# EAGLE board motor_controller (EAGLE 9.6.2)
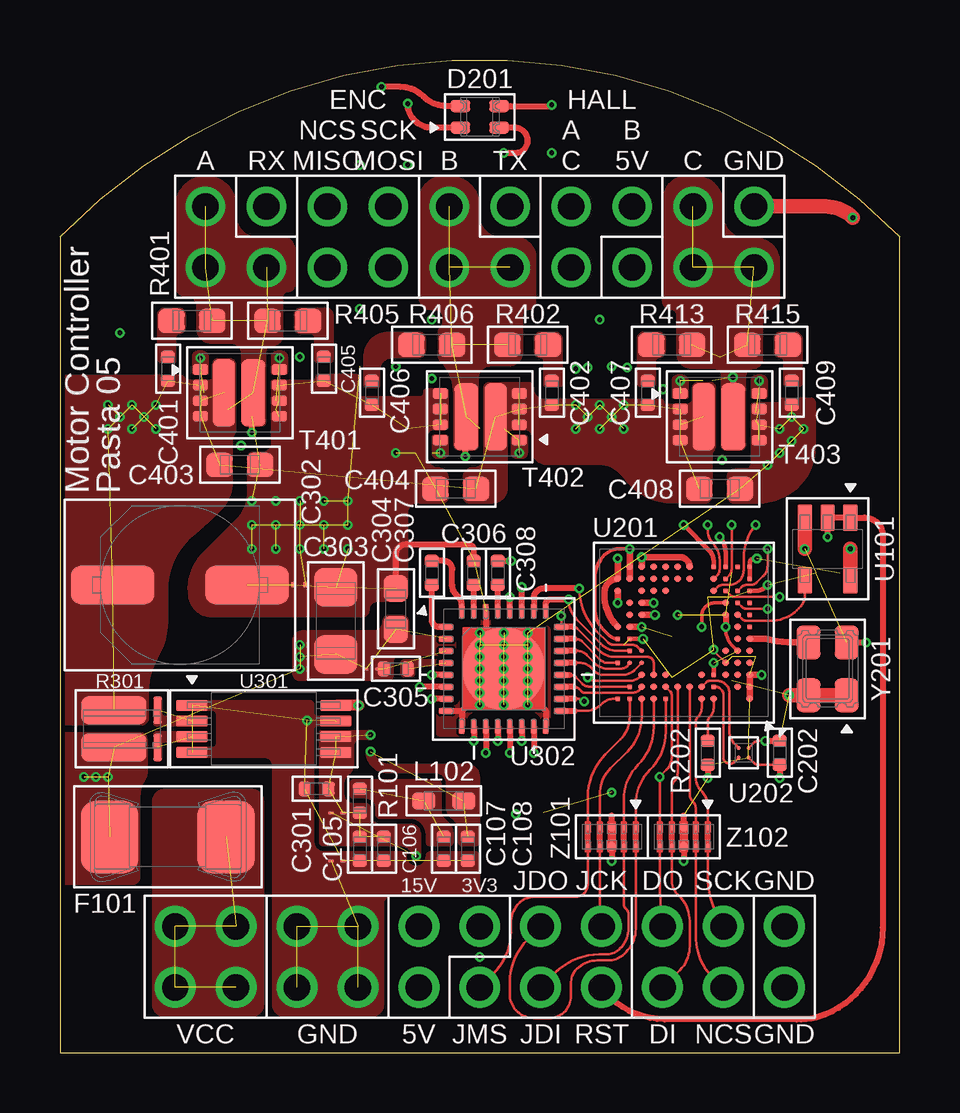
[diagram p4: board, top side]
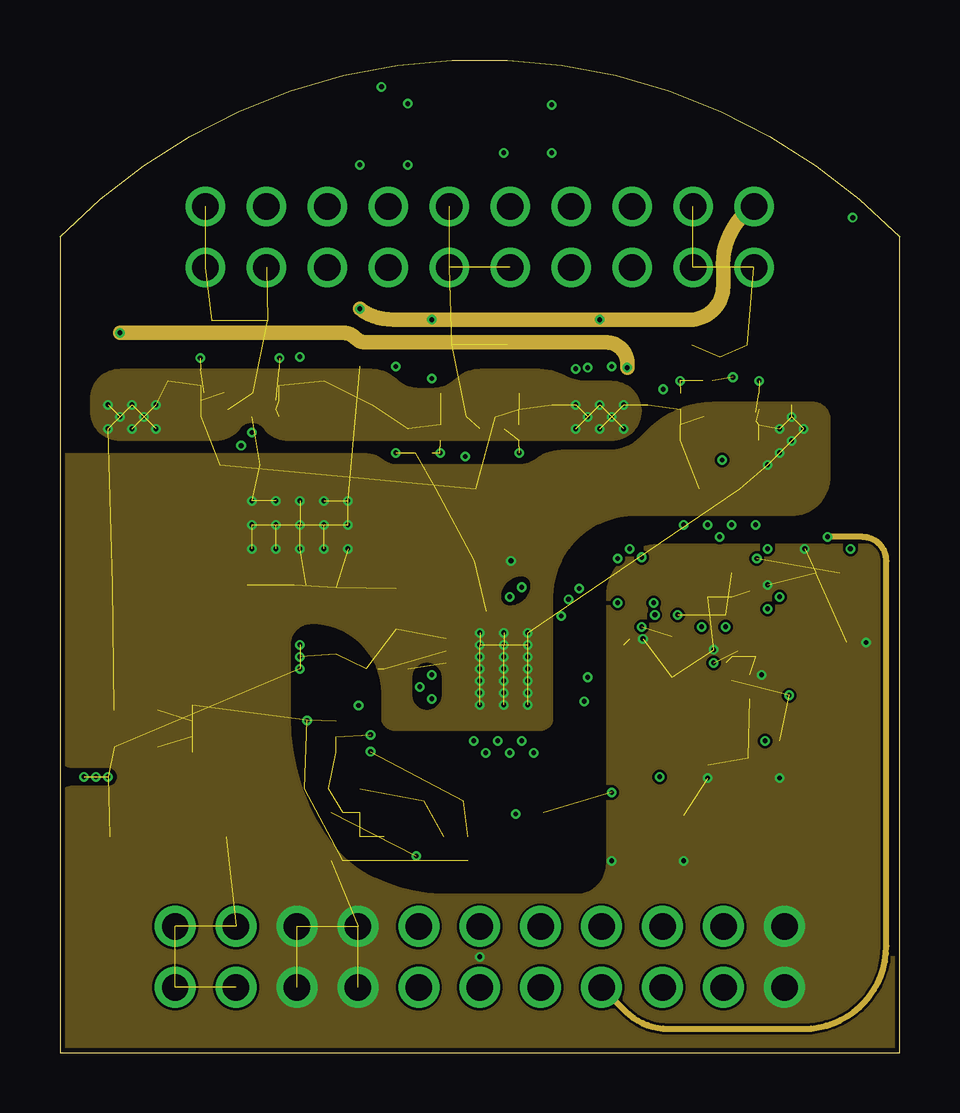
[diagram p5: board, inner layer Route2]
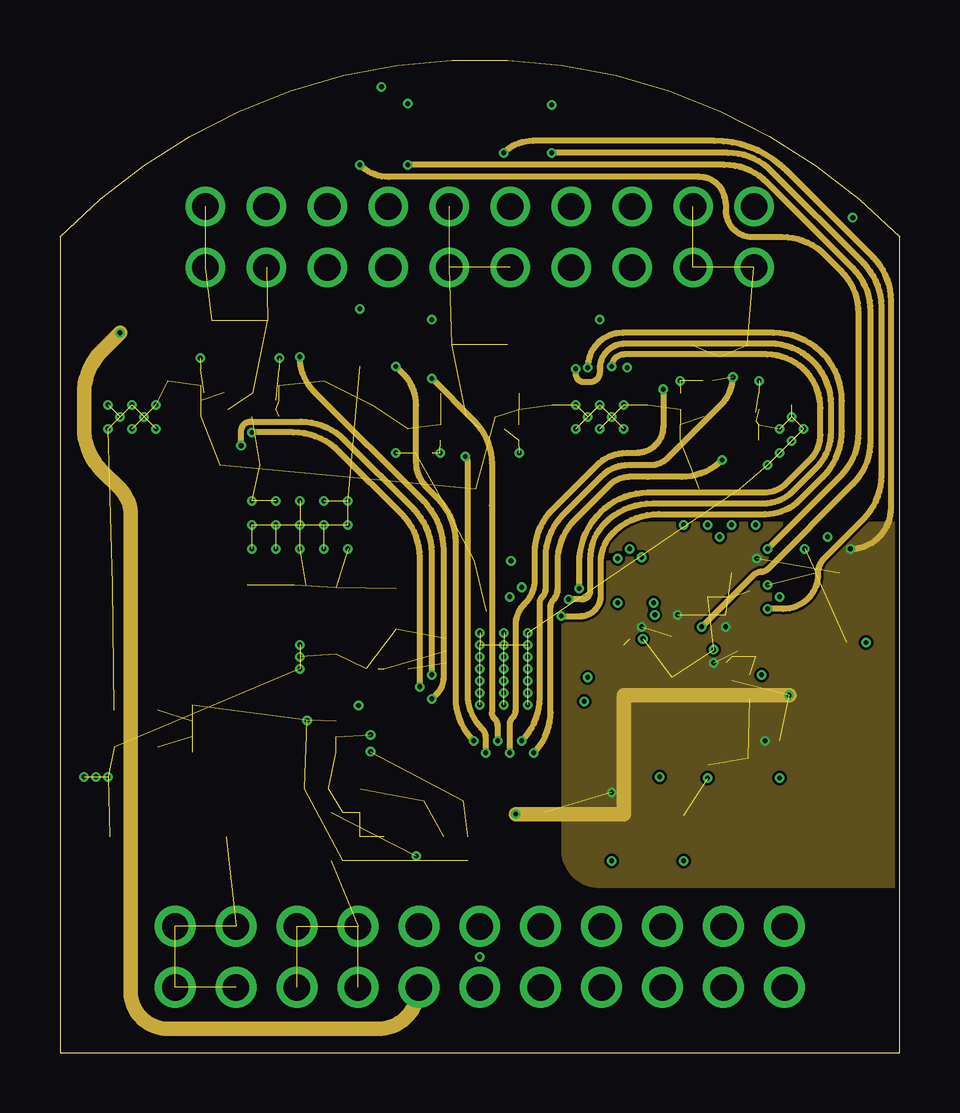
[diagram p6: board, inner layer Route15]
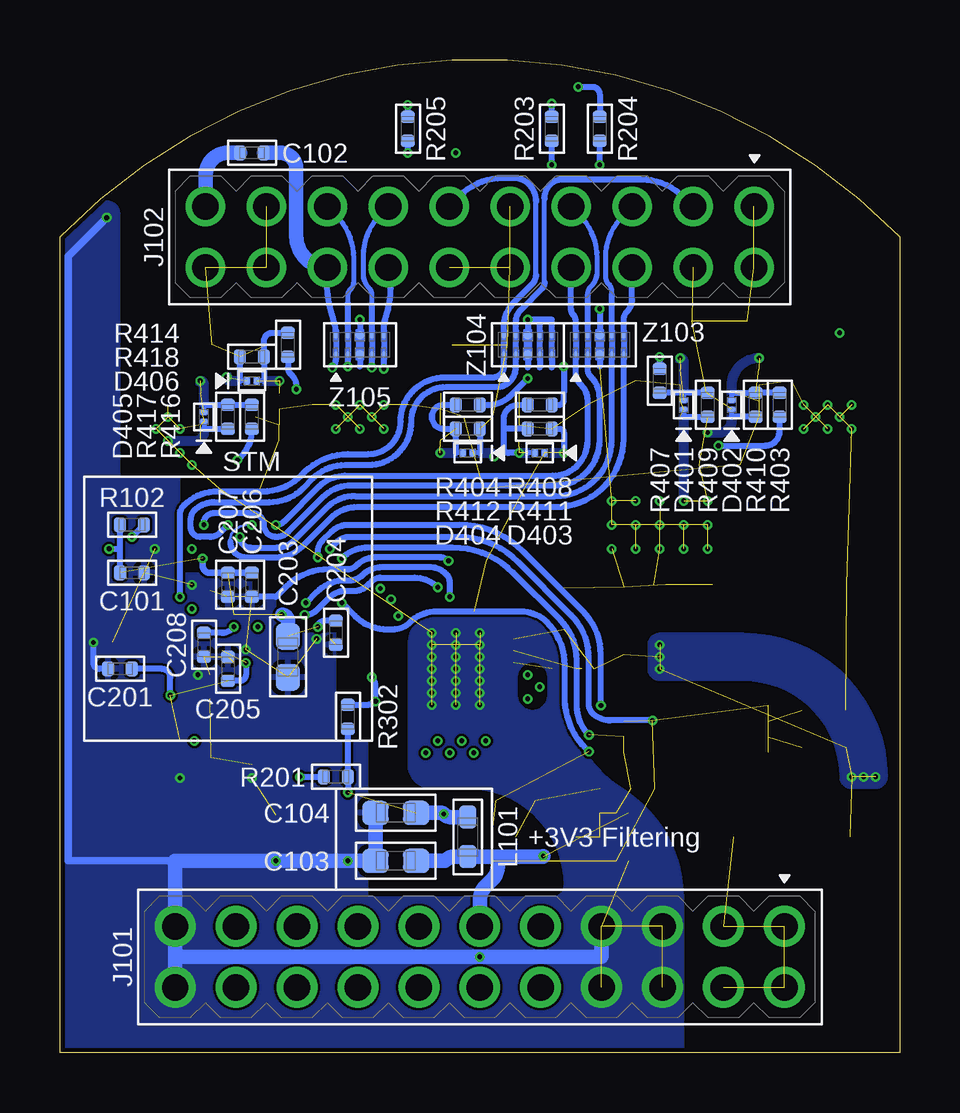
[diagram p7: board, bottom side, seen from below]

Size 35 x 41.37 mm. Coordinates in mm from the lower left corner, seen from the top.
Outline: 0,0 35,0 35,34 arc92 0,34 0,0
Copper layers (1+2*15+16): Top 0.035mm / dielectric 0.175mm / Route2 0.035mm / dielectric 1.13mm / Route15 0.035mm / dielectric 0.175mm / Bottom 0.035mm
Design rules "35u Robotics DRU No. 4 (4mil, 4 Layer, 0.2mm Drill)": minimum track width 4mil, minimum drill 0.2mm, track to track 4mil, track to pad 4mil, pad to pad 4mil, via to via 4mil, smd to smd 0mil, copper to edge 0.2mm, drill to drill 4mil, minimum pad ring 0.1mm, minimum via ring 0.1mm, stop-mask expansion 0.05mm, vias tented up to drill 0.45mm, thermal gap 0.2mm
Net classes: 0 default: width 0.1 mm, drill 0.2 mm, clearance 0.1 mm

## Footprints (pad centres in the part's own frame; a part is rotated, then mirrored left to right if it is on the bottom)
C0402 = smd 0.5 x 0.6: 1 -0.5,0; 2 0.5,0
C0603 = smd 1.1 x 1: 1 -0.85,0; 2 0.85,0
865080545012 = smd 1.6 x 3.5: N 0,2.8; P 0,-2.8
C1206 = smd 1.6 x 1.8: 1 -1.4,0; 2 1.4,0
WL-SFCX_0606 = smd 0.8 x 0.5: 1 0.8,0.45; 2 0.8,-0.45; 3 -0.8,-0.45; 4 -0.8,0.45
D15V0M1U2LP3 = smd 0.23 x 0.3: P1 -0.19,0; P2 0.19,0
157T = smd 2.4 x 3: 1 -2.43,0; 2 2.43,0
HDRV22W64P254_2X11_2794X508X854B = drill 1.1 pad 1.705: 1 -12.7,-1.27; 2 -12.7,1.27; 3 -10.16,-1.27; 4 -10.16,1.27; 5 -7.62,-1.27; 6 -7.62,1.27; 7 -5.08,-1.27; 8 -5.08,1.27; 9 -2.54,-1.27; 10 -2.54,1.27; 11 0,-1.27; 12 0,1.27; 13 2.54,-1.27; 14 2.54,1.27; 15 5.08,-1.27; 16 5.08,1.27; 17 7.62,-1.27; 18 7.62,1.27; 19 10.16,-1.27; 20 10.16,1.27; 21 12.7,-1.27; 22 12.7,1.27
61302021121 = drill 1.1: 1 -11.43,-1.27; 2 -11.43,1.27; 3 -8.89,-1.27; 4 -8.89,1.27; 5 -6.35,-1.27; 6 -6.35,1.27; 7 -3.81,-1.27; 8 -3.81,1.27; 9 -1.27,-1.27; 10 -1.27,1.27; 11 1.27,-1.27; 12 1.27,1.27; 13 3.81,-1.27; 14 3.81,1.27; 15 6.35,-1.27; 16 6.35,1.27; 17 8.89,-1.27; 18 8.89,1.27; 19 11.43,-1.27; 20 11.43,1.27
WE-CBF_0603(W=2.6) = smd 0.95 x 0.7: 1 -0.825,0; 2 0.825,0
R0402 = smd 0.5 x 0.6: 1 -0.5,0; 2 0.5,0
FC4L32 = smd 1.15 x 2.7: P1 -0.775,-0.25; P2 0.775,-0.25 | smd 1.15 x 0.35: S1 -0.775,1.575; S2 0.775,1.575
R0603 = smd 1.1 x 1: 1 -0.85,0; 2 0.85,0
SHORT4.35 = smd 0.2 x 0.2: P1 -0.25,0; P2 0.25,0
SHORT2.4 = smd 0.2 x 0.102: P1 -0.25,0; P2 0.25,0
SIZ260DT = smd 0.62 x 0.44: P1 -1.64,0.975; P2 -1.64,0.325; P3 -1.64,-0.325; P4 -1.64,-0.975; P5 1.64,-0.975; P6 1.64,-0.325; P7 1.64,0.325; P8 1.64,0.975 | smd 0.935 x 2.8: P9 -0.662,0 | smd 1.005 x 2.8: P10 0.557,0
SOT23-5 = smd 1.1 x 0.6: 1 -1.3,0.95; 2 -1.3,0; 3 -1.3,-0.95; 4 1.3,-0.95; 5 1.3,0.95
STM32F373V8H6 = smd 0.28 x 0.28: BOOT0 -1.25,2.75; NRST -2.25,-0.75; PA5 -1.25,-1.75; PA6 -1.25,-2.25; PA14 1.75,2.75; PA15 1.25,2.75; PB1 -0.25,-2.75; PB2 -0.25,-2.25; PB5 -0.75,1.75; PB6 -0.75,2.25; PB10 1.75,-2.25; PB15 1.75,-1.75; PC2 -1.75,-1.25; PC11 1.75,1.75; PC12 1.75,2.25; PC13 -2.75,1.75; PC14 -2.75,1.25; PC15 -2.75,0.75; PD0 1.25,1.75; PD1 1.25,2.25; PD2 0.75,1.75; PD3 0.75,2.25; PD4 0.25,2.25; PD6 -0.25,2.25; PD7 -0.75,2.75; PD8 1.25,-1.75; PD9 0.75,-1.75; PD11 2.25,-1.25; PD12 1.75,-1.25; PD14 2.25,-0.75; PD15 1.75,-0.75; PE0 -1.75,1.75; PE2 -2.25,2.25; PE3 -2.75,2.75; PE4 -2.75,2.25; PE5 -2.25,1.75; PE6 -2.25,1.25; PE7 0.25,-2.75; PE8 0.25,-2.25; PE9 0.75,-2.75; PE10 0.75,-2.25; PE11 1.25,-2.75; PE12 1.25,-2.25; PE13 1.75,-2.75; PE14 2.25,-2.75; PF0 -2.75,0.25; PF4 -1.75,0.75; PF9 -2.25,0.25; PF10 -2.25,-0.25; VBAT -2.25,0.75; VDD@2 -1.75,-0.75; VDD@3 2.25,-0.25; VDDSD3 2.75,-2.25; VDDSD12 2.75,-0.25; VREFSD+ 2.75,-1.75; VREFSD- 2.25,-2.25; VSS@1 -1.75,1.25 | smd 0.195 x 0.195: PA1 -2.25,-2.75; PA2 -1.75,-1.75; PA3 -1.75,-2.25; PA4 -1.75,-2.75; PA7 -1.25,-2.75; PA8 2.25,1.25; PA9 1.75,1.25; PA12 2.75,2.75; PA13 2.25,2.75; PB3 0.75,2.75; PB7 -1.25,2.25; PC0 -2.75,-0.75; PC1 -2.25,-1.25; PC3 -2.25,-1.75; PC7 2.25,0.75; PC8 1.75,0.75; PC9 2.75,1.25; PC10 2.25,2.25; PF1 -2.75,-0.25; PF2 -2.75,-1.25; VDD@1 -1.25,1.75; VDDA -2.75,-2.75; VREF+ -2.75,-2.25; VSS@3 2.25,0.25; VSSA -2.75,-1.75; VSSSD 2.75,0.25
CS0-4 = smd 0.163 x 0.163: P1 -0.2,0.2; P2 0.2,0.2; P3 0.2,-0.2; P4 -0.2,-0.2
TSSOP-8 = smd 1.3 x 0.45: 1 -3,0.975; 2 -3,0.325; 3 -3,-0.325; 4 -3,-0.975; 5 3,-0.975; 6 3,-0.325; 7 3,0.325; 8 3,0.975
QFN50P500X500X80-33T345 = smd 0.6 x 0.24: 1 -2.4,1.75; 2 -2.4,1.25; 3 -2.4,0.75; 4 -2.4,0.25; 5 -2.4,-0.25; 6 -2.4,-0.75; 7 -2.4,-1.25; 8 -2.4,-1.75; 17 2.4,-1.75; 18 2.4,-1.25; 19 2.4,-0.75; 20 2.4,-0.25; 21 2.4,0.25; 22 2.4,0.75; 23 2.4,1.25; 24 2.4,1.75 | smd 0.24 x 0.6: 9 -1.75,-2.4; 10 -1.25,-2.4; 11 -0.75,-2.4; 12 -0.25,-2.4; 13 0.25,-2.4; 14 0.75,-2.4; 15 1.25,-2.4; 16 1.75,-2.4; 25 1.75,2.4; 26 1.25,2.4; 27 0.75,2.4; 28 0.25,2.4; 29 -0.25,2.4; 30 -0.75,2.4; 31 -1.25,2.4; 32 -1.75,2.4 | smd 3.45 x 3.45: 33 0,0
830207192009 = smd 1.4 x 1: P1 -1.1,-0.8; P2 1.1,-0.8; P3 1.1,0.8; P4 -1.1,0.8
UDFN10 = smd 0.25 x 0.25: 1 1,0.4; 2 0.5,0.4; 4 -0.5,0.4; 5 -1,0.4; 6 -1,-0.4; 7 -0.5,-0.4; 9 0.5,-0.4; 10 1,-0.4 | smd 0.35 x 0.35: 3 0,0.4; 8 0,-0.4

## Placement (x,y rotation side)
C101  100n ±10% 50V X5R  [C0402]  32,20 0 bottom
C102  1u ±10% 25V X5R  [C0402]  27,37.5 180 bottom
C103  4u7 ±20% 6V3 X5R  [C0603]  21,8 180 bottom
C104  4u7 ±20% 6V3 X5R  [C0603]  21,10 180 bottom
C105  100n ±10% 50V X5R  [C0402]  12.5,8.5 270 top
C106  1u ±10% 25V X5R  [C0402]  13.5,8.5 270 top
C107  100n ±10% 50V X5R  [C0402]  16,8.5 270 top
C108  1u ±10% 25V X5R  [C0402]  17,8.5 270 top
C201  100n ±10% 50V X5R  [C0402]  32.5,16 180 bottom
C202  100n ±10% 50V X5R  [C0402]  30,12.5 270 top
C203  4u7 ±20% 6V3 X5R  [C0603]  25.5,16.5 270 bottom
C204  100n ±10% 50V X5R  [C0402]  23.5,17.5 270 bottom
C205  100n ±10% 50V X5R  [C0402]  28,16 90 bottom
C206  100n ±10% 50V X5R  [C0402]  27,19.5 270 bottom
C207  1u ±10% 25V X5R  [C0402]  28,19.5 270 bottom
C208  100n ±10% 50V X5R  [C0402]  29,17 270 bottom
C301  100n ±10% 50V X5R  [C0402]  10.7,11 180 top
C302  100u ±20% 35V  [865080545012]  5,19.5 270 top
C303  10u ±20% 50V X5R  [C1206]  11.5,18 90 top
C304  100n ±10% 50V X7R  [C0603]  14,18.5 90 top
C305  1u ±10% 25V X5R  [C0402]  14,16 0 top
C306  1u ±10% 25V X5R  [C0402]  17.25,20 90 top
C307  47n ±10% 50V X5R  [C0402]  15.5,20 90 top
C308  1u ±10% 25V X5R  [C0402]  18.25,20 90 top
C401  n.c.  [C0402]  4.5,28.5 90 top
C402  n.c.  [C0402]  20.5,27.5 90 top
C403  1u ±10% 50V X5R  [C0603]  7.5,24.5 0 top
C404  1u ±10% 50V X5R  [C0603]  16.5,23.5 180 top
C405  n.c.  [C0402]  11,28.5 270 top
C406  n.c.  [C0402]  13,27.5 270 top
C407  n.c.  [C0402]  24.5,27.5 90 top
C408  1u ±10% 50V X5R  [C0603]  27.5,23.5 0 top
C409  n.c.  [C0402]  30.5,27.5 270 top
D201  150066M153000  [WL-SFCX_0606]  17.5,39 180 top
D401  D15V0M1U2LP3  [D15V0M1U2LP3]  9,27 270 bottom
D402  D15V0M1U2LP3  [D15V0M1U2LP3]  7,27 270 bottom
D403  D15V0M1U2LP3  [D15V0M1U2LP3]  15,25 0 bottom
D404  D15V0M1U2LP3  [D15V0M1U2LP3]  18,25 0 bottom
D405  D15V0M1U2LP3  [D15V0M1U2LP3]  29,26.5 270 bottom
D406  D15V0M1U2LP3  [D15V0M1U2LP3]  27,28 180 bottom
F101  5A  [157T]  4.5,9 180 top
J101  61302221121  [HDRV22W64P254_2X11_2794X508X854B]  17.5,4 180 bottom
J102  61302021121  [61302021121]  17.5,34 180 bottom
L101  742792692  [WE-CBF_0603(W=2.6)]  18,9 90 bottom
L102  782632102  [WE-CBF_0603(W=2.6)]  16,10.5 0 top
R101  2R2 ±1% 50V 62.5mW  [R0402]  12.5,10.5 90 top
R102  1k ±1% 50V 62.5mW  [R0402]  32,22 0 bottom
R201  1k ±1% 50V 62.5mW  [R0402]  23.5,11.5 0 bottom
R202  1k ±1% 50V 62.5mW  [R0402]  27,12.5 90 top
R203  1k ±1% 50V 62.5mW  [R0402]  14.5,38.5 270 bottom
R204  1k ±1% 50V 62.5mW  [R0402]  12.5,38.5 270 bottom
R205  1k ±1% 50V 62.5mW  [R0402]  20.5,38.5 270 bottom
R301  FC4L32R010FER  [FC4L32]  2.5,13.5 270 top
R302  1k ±1% 50V 62.5mW  [R0402]  23,14 270 bottom
R401  n.c.  [R0603]  5.5,30.5 180 top
R402  n.c.  [R0603]  19.5,29.5 0 top
R403  0R ±1% 50V 62.5mW  [R0402]  5,27 270 bottom
R404  0R ±1% 50V 62.5mW  [R0402]  18,27 0 bottom
R405  n.c.  [R0603]  9.5,30.5 180 top
R406  n.c.  [R0603]  15.5,29.5 0 top
R407  0R ±1% 50V 62.5mW  [R0402]  10,28 90 bottom
R408  0R ±1% 50V 62.5mW  [R0402]  15,27 0 bottom
R409  n.c.  [R0402]  8,27 90 bottom
R410  n.c.  [R0402]  6,27 90 bottom
R411  n.c.  [R0402]  15,26 180 bottom
R412  n.c.  [R0402]  18,26 180 bottom
R413  n.c.  [R0603]  25.5,29.5 180 top
R414  0R ±1% 50V 62.5mW  [R0402]  25.5,29.5 270 bottom
R415  n.c.  [R0603]  29.5,29.5 180 top
R416  0R ±1% 50V 62.5mW  [R0402]  27,26.5 270 bottom
R417  n.c.  [R0402]  28,26.5 90 bottom
R418  n.c.  [R0402]  27,29 0 bottom
SHORT101  SHORT4.35  [SHORT4.35]  10,19.5 0 top
SHORT102  SHORT2.4  [SHORT2.4]  11.55,10 180 top
SHORT103  SHORT2.4  [SHORT2.4]  11.55,8 180 top
SHORT301  SHORT2.4  [SHORT2.4]  13,16 0 top
T401  SIZ260DT  [SIZ260DT]  7.5,27.5 0 top
T402  SIZ260DT  [SIZ260DT]  17.5,26.5 180 top
T403  SIZ260DT  [SIZ260DT]  27.5,26.5 0 top
U101  SN74AHC1G125DBVR  [SOT23-5]  32,21 270 top
U201  STM32F373V8H6  [STM32F373V8H6]  26,17.5 180 top
U202  24CW1280T-I/CS0668  [CS0-4]  28.5,12.5 270 top
U301  INA240A3PWR  [TSSOP-8]  8.5,13.5 0 top
U302  DRV8350FSRTVR  [QFN50P500X500X80-33T345]  18.5,16 0 top
Y201  8 MHz  [830207192009]  32,16 90 top
Z101  ESD8704  [UDFN10]  23,9 0 top
Z102  ESD8704  [UDFN10]  26,9 0 top
Z103  ESD8704  [UDFN10]  12.5,29.5 180 bottom
Z104  ESD8704  [UDFN10]  15.5,29.5 180 bottom
Z105  ESD7004  [UDFN10]  22.5,29.5 180 bottom

## Tracks (layer width: path | path; a pad name or v marks a point on that pad's centre or on a via)
+3V3  (via drill 0.2)  (8 unrouted)
  Top 0.102: U202.P1 28.9,12.9 arc-46 29.15,13 v29.4,13
  Top 0.152: U201.VBAT 28.05,16.95 arc-49 v27.75,17.75
  Top 0.195: U201.VDD@1 v27.25,16.25 | U201.VREF+ U201.VDDA 28.75,20.4 arc-90 28.95,20.6 v29.05,20.6
  Top 0.25: 18.85,38.55 D201.4
  Top 0.254: 18.85,38.55 18.95,38.55 arc-90 19.5,38 arc-90 19,37.5 v18.5,37.5 | U201.VDD@2 v27.75,17.75 | v29.4,13 C202.1
  Top 0.28: U201.VDD@3 v24.25,17.75
  Top 0.61: U101.5 v32.95,21 | v30.4,14.9 Y201.P4 Y201.P1
  Route15 0.254: v32.95,21 arc90 34.65,22.7 34.65,31.35 arc45 33.91,33.14 30.29,36.76 arc45 27.29,38 19.71,38 arc45 v18.5,37.5
  Route15 0.61: v19,9.95 23.5,9.95 23.5,14.9 v30.4,14.9
  Bottom 0.254: C101.1 32.5,21 | 32.5,21 R102.1 | v32.95,21 32.5,21 | C204.1 24,18 arc-90 v24.25,17.75 | v27.25,16.25 U201.VDD@1 arc90 27.5,15.5 C205.1 | v27.75,17.75 27.85,17.65 arc49 28.25,17.5 C208.1 | v30.4,14.9 30.4,15.65 arc-90 30.75,16 C201.1 | R302.2 R201.2 v23,10.85
  Bottom 0.28: v29.05,20.6 29.05,20.3 arc-90 28.75,20 C207.1 C206.1
  Bottom 0.61: C203.1 25.5,18 arc-90 v25.75,18.25 | L101.2 18.7,9.82 arc45 v19,9.95 arc-45 19.12,10 C104.1
  pour Route15: 35,22 24.5,22 arc90 21,18.5 21,8.5 arc90 22.5,7 35,7
+3V3_  (via drill 0.2)  (1 unrouted)
  Bottom 0.61: C103.1 19.02,8 arc-45 18.9,8.05 arc45 18.6,8.18 L101.1 16.75,8.18 | 16.75,8.18 14.88,8.18 arc-90 v14.85,8.2 | J101.11 17.5,6.34 arc45 17.24,6.96 16.96,7.24 arc-45 16.75,7.75 16.75,8.18
  pour Top (no thermals): 15.05,9.1 15.05,8.2 arc-90 14.85,8 arc-90 14.65,8.2 arc90 14.25,8.6 11,8.6 arc-90 10.8,8.8 10.8,13.35 arc-90 10.9,13.45 12.95,13.45 arc-90 13.15,13.25 arc-90 12.95,13.05 12.5,13.05 arc90 12.25,12.8 12.25,12 arc-53 12.05,11.6 arc53 11.85,11.2 11.85,10.8 arc90 12.25,10.4 12.75,10.4 arc-90 12.95,10.2 12.95,9.95 arc90 13.35,9.55 14.6,9.55 arc-90
+5V  (via drill 0.2)
  Route2 0.61: v23.65,28.55 23.65,28.75 arc90 22.8,29.6 12.76,29.6 arc-45 12.32,29.79 12.3,29.8 arc45 11.82,30 v2.5,30
  Route15 0.61: J101.10 arc-90 13.23,1 4.5,1 arc-90 2.95,2.55 2.95,22.41 arc45 2.5,23.5 1.74,24.26 arc-45 1,26.05 1,27.45 arc-45 1.74,29.24 v2.5,30
  Bottom 0.25: Z105.10 23.5,30 arc-21 23.6,30.55 arc24 J102.16 | v23.65,28.55 arc-45 23.5,28.91 Z105.1
  Bottom 0.254: Z105.10 Z105.1
  Bottom 0.61: C102.1 25.8,37.5 arc90 25.15,36.85 25.15,34.03 arc-90 J102.16
A
  cutout Route2: 14.7,15.65 14.7,14.9 arc90 15.3,14.3 arc90 15.9,14.9 15.9,15.65 arc90 15.3,16.25 arc90
  cutout Route2: 18.75,18.65 arc90 19.6,19.5 arc90 19.25,19.85 arc90 18.4,19 arc90
  cutout Bottom: 14.7,15.65 14.7,14.9 arc90 15.3,14.3 arc90 15.9,14.9 15.9,15.65 arc90 15.3,16.25 arc90
BOOT0
  Top 0.102: U201.BOOT0 27.25,14.36 arc-45 27.1,14 arc45 27,13.76 R202.2
CONTROLLER_ENABLE
  Top 0.102: U201.PA8 arc-64 23.35,16 arc0 23.1,16 22.83,16 arc-45 22.35,16.2 21.98,16.57 arc45 21.55,16.75 21.45,16.75
  Top 0.24: 21.45,16.75 U302.22
CONTROLLER_FAULT
  Top 0.102: U201.PA12 23.08,14.75 arc45 22.6,14.55 arc-45 21.88,14.25 21.45,14.25
  Top 0.24: U302.17 21.45,14.25
CONTROLLER_INHA
  Top 0.102: U201.PC9 22.85,16.25 arc-45 22.51,16.39 21.76,17.14 arc45 21.5,17.25 21.45,17.25
  Top 0.24: 21.45,17.25 U302.23
CONTROLLER_INHC  (via drill 0.2)
  Top 0.24: U302.27 v19.25,19.4
  Top 0.28: U201.PD15 v24.8,18.25
  Bottom 0.254: v24.8,18.25 arc-45 24.29,18.46 23.78,18.97 arc45 23.1,19.25 22.75,19.25 arc-45 22.15,19.5 21.99,19.66 arc45 21.65,19.8 20.22,19.8 arc45 v19.25,19.4
CONTROLLER_INLC  (via drill 0.2)
  Top 0.24: U302.28 v18.75,19
  Top 0.28: U201.PD12 v24.75,18.75
  Bottom 0.254: v18.75,19 18.75,19.59 arc-45 18.9,19.95 arc-45 19.62,20.25 21.55,20.25 arc-45 22.4,19.9 arc45 22.88,19.7 23.1,19.7 arc-45 24.3,19.2 v24.75,18.75
CONTROLLER_MISO  (via drill 0.2)
  Top 0.102: U201.PC11 arc-53 23.75,15.5 22.36,15.5 arc-45 v22,15.65 | v21.85,14.65 arc45 21.61,14.75 21.45,14.75
  Top 0.24: 21.45,14.75 U302.18
  Bottom 0.254: v22,15.65 arc45 21.85,15.29 v21.85,14.65 arc45 22.21,14.5 R302.1
CONTROLLER_MOSI
  Top 0.102: U201.PC12 arc-64 23.85,15 21.91,15 arc-45 21.72,15.08 21.65,15.15 arc45 21.41,15.25
  Top 0.24: 21.41,15.25 U302.19
CONTROLLER_NCS
  Top 0.102: U201.PA9 23.95,15.95 arc-44 23.45,15.75 22.65,15.75 arc-45 22.31,15.89 22.15,16.05 arc45 21.67,16.25 21.45,16.25
  Top 0.24: 21.45,16.25 U302.21
CONTROLLER_SCK
  Top 0.102: U201.PC10 22.11,15.25 arc-45 21.75,15.4 21.51,15.64 arc45 21.25,15.75
  Top 0.24: U302.20 21.25,15.75
CPH
  Top 0.24: U302.1 15.8,17.75 arc-90 15.5,18.05 C307.1
CPL
  Top 0.24: U302.32 16.75,18.64 arc45 16.6,19 16.53,19.07 arc-45 16.35,19.5 16.35,20.15 arc90 16,20.5 C307.2
CURRENT  (via drill 0.2)
  Top 0.28: U201.PE13 v24.25,20.65 25.85,20.65 arc-90 U201.PB1
  Top 0.45: v12.45,14.47 U301.8
  Bottom 0.254: v24.25,20.65 24.25,20.9 arc45 24.07,21.33 23.68,21.72 arc45 23,22 18.35,22 arc45 15.71,20.91 13.19,18.39 arc45 12.45,16.6 v12.45,14.47
DVDD
  Top 0.24: U302.29 C308.1
EEPROM_SCL
  Top 0.102: U202.P4 28.15,12.85 arc-45 27.9,13.45 arc0 27.9,14.75 27.9,15.06 arc45 27.8,15.3 27.74,15.36 arc45 27.4,15.5 27.07,15.5 arc45 26.95,15.45 U201.PB6
EEPROM_SDA
  Top 0.102: U202.P3 28.13,12.13 arc-129 27.65,12.3 27.65,14.98 arc45 27.6,15.1 27.52,15.19 arc45 27.36,15.25 U201.PB7
ENCODER_MISO  (via drill 0.2)
  Top 0.102: U201.PA6 27.4,19.9 arc46 27.5,20.15 27.5,20.55 arc33 27.35,21.05 arc7 27.2,21.25 arc-41 27,21.8 v27,22
  Bottom 0.102: v27,22 27.15,22 arc-45 27.75,21.75 27.76,21.74 arc-45 27.9,21.4 27.9,21.3
  Bottom 0.25: 27.9,21.3 arc-90 27.25,20.65 26,20.65 arc-45 24.89,21.11 23.71,22.29 arc45 22.6,22.75 14.34,22.75 arc-90 11.5,25.59 Z103.5 Z103.6 11.5,30.54 arc45 11.35,30.9 arc-45 11.15,31.38 J102.6
ENCODER_MOSI  (via drill 0.2)
  Top 0.195: U201.PA7 27.25,20.5 arc48 27.05,20.95 v26,22
  Bottom 0.25: J102.8 13.69,30.97 arc-45 13.6,30.75 arc45 13.5,30.51 Z103.10 Z103.1 13.5,28.4 arc-45 13.25,27.8 arc45 13,27.2 13,25.52 arc90 14.47,24.05 23.12,24.05 arc-45 24.19,23.61 25.66,22.14 arc45 v26,22
ENCODER_NCS  (via drill 0.2)
  Top 0.195: U201.PA4 27.75,20.85 arc42 v27.5,21.5
  Bottom 0.203: 11.51,34.91 arc-45 12.25,33.12 12.25,32.36 arc-45 12.1,32 arc45 12,31.76 12,31.61
  Bottom 0.25: v27.5,21.5 arc-90 27.05,21.05 25.95,21.05 arc-45 25.27,21.33 23.89,22.71 arc45 22.7,23.2 14.34,23.2 arc-90 12,25.54 Z103.4 Z103.7 12,31.61 | 11.51,34.91 J102.5
ENCODER_SCK  (via drill 0.2)
  Top 0.102: U201.PA5 27.4,19.4 arc-46 27.65,19.5 27.9,19.5 arc90 28.5,20.1 28.5,20.6 arc-39 v29,22
  Bottom 0.203: 13,31.59 arc45 12.85,31.95 arc-45 12.6,32.55 12.6,33.13 arc-45 13.34,34.92
  Bottom 0.25: 29,22.11 arc45 28.9,22.35 arc45 28.54,22.5 27.01,22.5 arc45 26.65,22.35 26.64,22.34 arc45 26.5,22 arc-90 26,21.5 arc-45 25.49,21.71 24.04,23.16 arc45 22.85,23.65 14.36,23.65 arc-90 12.5,25.51 12.5,27.3 arc-45 12.85,28.15 arc45 13,28.51 Z103.2 Z103.9 13,31.59 | 13.34,34.92 J102.7
  Bottom 0.254: v29,22 29,22.11
GHA  (via drill 0.2)
  Top 0.24: U302.5 v15.5,15.75
  Route15 0.254: v15.5,15.75 15.5,20.85 arc45 14.76,22.64 11.84,25.56 arc45 10.05,26.3 7.95,26.3 arc90 7.55,25.9 v7.55,25.3
  Bottom 0.254: v7.55,25.3 5.6,25.3 arc-90 5,25.9 R403.2
GHB  (via drill 0.2)
  Top 0.24: U302.12 v18.25,13
  Route15 0.25: v15.5,28.1 17.26,26.34 arc-45 18,24.55 18,22.8
  Route15 0.254: v18.25,13 18.25,13.59 arc45 18.1,13.95 arc-45 18,14.19 18,22.8
  Bottom 0.254: R404.2 17.17,27 arc-45 16.2,27.4 v15.5,28.1
GHC  (via drill 0.2)
  Top 0.24: U302.13 v18.75,12.5
  Route15 0.25: 23.6,25 24.04,25 arc90 25.15,26.11 v25.15,27.65
  Route15 0.254: v18.75,12.5 18.75,13.71 arc-45 18.85,13.95 arc45 19,14.31 19,17.78 arc-45 19.4,18.75 arc45 19.8,19.72 19.8,20.85 arc-45 20.54,22.64 22.41,24.5 arc-45 23.6,25
  Bottom 0.254: R414.2 25.5,28.55 arc-45 25.39,28.29 25.32,28.21 arc45 25.15,27.82 v25.15,27.65
GLA  (via drill 0.2)
  Top 0.24: U302.7 v15.5,14.75
  Route15 0.254: v15.5,14.75 15.72,14.97 arc45 16,15.65 16,20.95 arc45 15.15,23 10.6,27.55 arc-45 v10,29
  Bottom 0.254: R407.2 v10,29
GLB  (via drill 0.2)
  Top 0.24: U302.10 v17.25,13
  Route15 0.25: 16.5,14.8 16.5,21.3 arc45 15.76,23.09 15.3,23.55 arc-45 14.85,24.64 14.85,24.75
  Route15 0.254: v17.25,13 v17.24,13.01 arc-45 16.5,14.8 | 14.85,24.75 14.85,27 arc45 14.32,28.28 v14,28.6
  Bottom 0.254: v14,28.6 14,27.5 arc-90 14,27.5 14,27.2 arc90 14.2,27 R408.2
GLC  (via drill 0.2)
  Top 0.24: U302.15 v19.75,12.5
  Route15 0.25: v27.6,24.7 arc-45 25.91,24 24.5,24
  Route15 0.254: v19.75,12.5 arc45 20.45,14.19 20.45,18.61 arc-45 20.55,18.85 arc45 20.75,19.33 20.75,20.45 arc-45 21.49,22.24 22.93,23.68 arc-45 23.7,24 24.5,24
  Bottom 0.25: 27.49,24.8 v27.6,24.7
  Bottom 0.254: R416.2 arc45 27.49,24.8
GND  (via drill 0.2)  (32 unrouted)
  Top 0.102: U202.P2 28.9,12.1 arc44 29.15,12 C202.2 | U201.VSS@1 27.29,16.71 arc-45 v27.25,16.8
  Top 0.195: U201.VSS@3 v24.3,17.25 | U201.VSSA 29,19.25 arc53 v29.5,19.5
  Top 0.25: Z101.3 23,9.9 | Z102.3 26,9.9
  Top 0.254: R202.1 v27,11.45 | C202.2 v30,11.45 | Y201.P2 v33.6,17.1 | Z101.8 v23,8 | Z102.8 v26,8 | C308.2 v18.8,20.5
  Top 0.28: U201.PE3 U201.PE4 U201.PC13 v29.25,15.75
  Top 0.35: Z102.3 Z102.8 | Z101.3 Z101.8
  Top 0.61: U101.3 v31.05,21 | v33.05,34.8 arc45 31.91,35.27 J102.19
  Route2 0.61: J102.19 arc61 27.65,32.6 27.65,31.95 arc-90 26.25,30.55 v22.5,30.55 v15.5,30.55 13.9,30.55 arc-36 v12.5,31
  Bottom 0.25: v12.5,31 Z103.8 | Z104.8 v15.5,30.55 15,30.55 | v22.5,30.55 Z105.8 | Z103.3 12.5,28.6 | Z104.3 15.5,28.55 | Z105.3 22.5,28.6 | 15,28.55 Z104.4 Z104.7 15,30.55 | 14.5,28.55 Z104.5 Z104.6 14.5,30.55 15,30.55
  Bottom 0.254: C201.2 33.35,16 arc90 33.6,16.25 v33.6,17.1 | v18.8,20.5 arc-45 19.16,20.65 21.8,20.65 arc-45 22.65,20.3 arc45 23.01,20.15 23.8,20.15 arc-45 25.59,19.41 26,19 C206.2
  Bottom 0.305: 30.2,8 34.65,8 34.65,33.2 v33.05,34.8
  Bottom 0.35: Z105.8 Z105.3 | Z103.8 Z103.3 | Z104.3 Z104.8
  Bottom 0.61: C104.2 C103.2 v23,8 v26,8 30.2,8 J101.21 30.2,4 | J101.22 30.2,4 | J101.7 12.42,4 v17.5,4 30.2,4 | C102.2 28,37.5 arc-90 28.93,36.57 J102.19
  other vias: 8,22 9,22 9,21 10,21 10,22 11,22 11,21 12,22 8,21 10,23 11,23 12,23
  pour Bottom: 35,24 30,24 30,20 27,20 27,19 26,19 26,17.5 23.5,17.5 23.5,13 22.15,13 22.15,6.5 9.15,6.5 9.15,0 35,0
  pour Bottom (no thermals): 9,6.5 9,0 35,0 35,6.5
  pour Bottom: 32.5,22 35,22 35,35.5 33,35.5 arc90 32.5,35
  pour Top (no thermals): 12.5,19 12.5,23.5 9,23.5 6.5,21 6.5,19
  pour Route2 (no thermals): 9.15,8.8 9.15,0 35,0 35,6.5 15.98,6.5 arc-47 10.68,8.8
  pour Route2 (no thermals): 35,0 21.5,0 21.5,6.5 arc90 22.9,7.9 22.9,19 arc-90 25,21.1 35,21.1
  pour Top (no thermals): 6.4,14.25 4.9,14.25 arc-90 4.85,14.3 4.85,14.65 arc-90 4.9,14.7 10.4,14.7 arc-90 10.6,14.5 10.6,14.15 arc90 10.7,14.05 12.05,14.05 arc-90 12.15,13.95 12.15,13.7 arc-90 12.05,13.6 10.7,13.6 arc90 10.6,13.5 10.6,8.8 arc90 11,8.4 14.25,8.4 arc-90 14.45,8.2 arc90 14.85,7.8 arc90 15.25,8.2 arc-90 15.45,8.4 17.3,8.4 arc-90 17.5,8.2 17.5,6.65 arc-90 17.35,6.5 13.8,6.5 arc90 13.5,6.2 13.5,2 arc-90 13,1.5 9.35,1.5 arc-90 8.85,2 8.85,11.95 arc90 8.5,12.3 4.9,12.3 arc-90 4.85,12.35 4.85,12.7 arc-90 4.9,12.75 6.4,12.75 arc90 6.5,12.85 6.5,14.15 arc90
  pour Route2 (no thermals): 16.5,0 16.5,6.5 arc-23 13.5,7 arc-36 11,9 arc-33 9.5,14 9.5,17 arc-90 10.5,18 arc-90 13.5,15 13.5,14 arc90 13.95,13.55 20.04,13.55 arc90 20.45,13.96 20.45,19 arc-90 23.95,22.5 30.5,22.5 arc90 32,24 32,26.4 arc90 31.4,27 27.2,27 arc44 24.7,26 24.25,25.55 arc-44 22.87,25 21.05,25 arc40 19.9,24.65 arc-37 19.15,24.4 14.11,24.4 arc-40 13.36,24.65 arc39 12.79,24.85 0,24.85 0,12.5 arc90 0.5,12 2,12 arc-90 2.5,11.5 arc-90 2,11 0.5,11 arc90 0,10.5 0,0
HALL_A  (via drill 0.2)
  Top 0.102: U201.PD0 24.75,16.25 arc90 24.5,16.5 23.15,16.5 arc-46 22.45,16.8 21.57,17.68 arc45 21.4,17.75 | U302.24 v20.9,18.2
  Top 0.24: 21.4,17.75 U302.24
  Route15 0.254: v20.9,18.2 21.7,18.2 arc90 22.55,19.05 22.55,20.46 arc-45 23.05,21.66 arc-45 24.95,22.45 29.4,22.45 arc45 30.85,23.05 31.81,24.01 arc45 32.6,25.92 32.6,27.16 arc90 29.76,30 23.45,30 arc90 v22,28.55
  Bottom 0.203: J102.13 21.61,34.97 arc-45 22.35,33.18 22.35,32.45 arc-45 22.1,31.85 arc45 22,31.61 22,31.16
  Bottom 0.25: Z105.7 22,30.2
  Bottom 0.254: Z105.7 Z105.4 v22,28.55 | 22,30.2 22,31.16
HALL_B  (via drill 0.2)
  Top 0.102: U201.PC7 23.3,16.75 arc-46 22.55,17.05 21.55,18.05 arc-45 v21.2,18.9
  Top 0.24: U302.25 20.25,18.7 arc-90 20.45,18.9 v21.2,18.9 arc-90 v21.2,18.9
  Route15 0.254: v21.2,18.9 21.76,18.9 arc45 22,19 arc45 22.1,19.24 22.1,20.59 arc-45 22.71,22.08 arc-45 24.7,22.9 29.34,22.9 arc45 30.55,23.4 31.55,24.4 arc45 32.15,25.85 32.15,27.01 arc90 29.61,29.55 23.55,29.55 arc90 22.5,28.5 22.5,28.35 arc-90 22.1,27.95 21.85,27.95 arc-90 21.5,28.3 v21.5,28.5
  Bottom 0.25: Z105.6 21.5,30.1 arc19 21.4,30.7 arc-31 J102.14
  Bottom 0.254: Z105.6 Z105.5 v21.5,28.5
HALL_C  (via drill 0.2)
  Top 0.102: U201.PC8 24.1,16.9 arc46 23.85,17 23.12,17 arc-44 22.83,17.12 22.39,17.56 arc-45 v21.65,19.35
  Top 0.24: v21.65,19.35 20.15,19.35 arc90 19.75,18.95 U302.26
  Route15 0.254: v21.65,19.35 21.65,20.4 arc-45 22.54,22.54 arc-45 24.5,23.35 29.33,23.35 arc45 30.3,23.75 31.28,24.73 arc45 31.7,25.75 31.7,26.87 arc90 29.47,29.1 23.5,29.1 arc90 v23,28.6
  Bottom 0.203: J102.15 23.49,34.91 arc45 22.75,33.12 22.75,32.16 arc45 22.9,31.8 arc-45 23,31.56 23,31.24
  Bottom 0.25: Z105.9 23,30.2
  Bottom 0.254: Z105.9 Z105.2 v23,28.6 | 23,30.2 23,31.24
HEARTBEAT_BLUE  (via drill 0.2)
  Top 0.102: U201.PC1 28.4,18.6 arc46 28.65,18.5 v29.5,18.5
  Route15 0.254: v29.5,18.5 30.15,18.5 arc90 31.6,19.95 31.6,20 arc-45 31.85,20.6 33.51,22.26 arc45 34.25,24.05 34.25,31.1 arc45 33.51,32.89 29.64,36.76 arc45 27.85,37.5 v20.5,37.5
  Bottom 0.254: v20.5,37.5 R205.2
HEARTBEAT_GREEN  (via drill 0.2)
  Top 0.102: v29.5,21 29.5,20.29 arc-49 29.3,19.85 29.05,19.6 arc-46 28.8,19.5 28.65,19.5 arc46 28.4,19.4 U201.PC3
  Route15 0.254: v29.5,21 32.56,24.06 arc45 33.3,25.85 33.3,30.8 arc45 32.56,32.59 31.89,33.26 arc45 30.1,34 28.85,34 arc-90 27.75,35.1 27.75,35.4 arc90 26.65,36.5 13.71,36.5 arc-45 v12.5,37
  Bottom 0.254: v12.5,37 R204.2
HEARTBEAT_RED  (via drill 0.2)
  Top 0.152: U201.PC2 27.3,18.75 arc90 26.75,18.2 v26.75,17.75
  Route15 0.254: v26.75,17.75 28.91,19.91 arc-45 29.25,20.05 arc45 29.51,20.16 33.06,23.71 arc45 33.8,25.5 33.8,30.9 arc45 33.06,32.69 29.49,36.26 arc45 27.7,37 v14.5,37
  Bottom 0.254: v14.5,37 R203.2
JTCK
  Top 0.102: U201.PA14 24.25,14 arc-45 23.65,12.55 22.95,11.85 arc45 22.5,10.76 Z101.4 | Z101.7 22.5,5.46 arc45 J101.15
  Top 0.254: Z101.7 Z101.4
JTDI
  Top 0.102: Z101.2 23.5,10.55 arc-45 24.1,12 arc45 24.75,13.57 U201.PA15 | Z101.9 23.5,6.24 arc45 23.6,6 arc-45 23.7,5.76 23.7,5.2 arc-45 23.35,4.35 arc-45 22.75,4.1 22.46,4.1 arc45 20.67,3.36 J101.14
  Top 0.254: Z101.9 Z101.2
JTDO
  Top 0.102: Z101.1 24,10.35 arc-45 24.6,11.8 arc45 25.25,13.37 U201.PB3 | Z101.10 24,5.17 arc-45 23.6,4.2 23.53,4.13 arc-45 22.85,3.85 22.39,3.85 arc45 21.55,3.5 arc45 21.3,2.9 21.3,2.35 arc-90 20.4,1.45 19.75,1.45 arc-90 18.75,2.45 18.75,2.93 arc-45 19.49,4.72 J101.13
  Top 0.254: Z101.10 Z101.1
JTMS
  Top 0.102: U201.PA13 23.75,14 arc-45 23.36,13.06 22.74,12.44 arc45 22,10.65 Z101.5 | Z101.6 22,7.01 arc-45 21.85,6.65 arc-45 21.49,6.5 19.75,6.5 arc45 19.15,6.25 arc45 18.8,5.41 18.8,5.08 arc-45 18.06,3.29 J101.12
  Top 0.254: Z101.6 Z101.5
MAINBUS_MISO  (via drill 0.2)
  Top 0.102: Z102.6 25,7.4 arc6 J101.17 | U201.PD3 25.45,15.05 arc-45 25.5,14.93 25.5,12.3 arc-45 25.29,11.79 v25,11.5 Z102.5
  Top 0.254: Z102.6 Z102.5
  Bottom 0.254: v25,11.5 R201.1
MAINBUS_MOSI
  Top 0.102: Z102.7 25.5,7.25 arc46 25.8,6.55 arc-46 26.25,5.5 26.25,4.45 arc-44 25.85,3.45 arc-4 J101.18 | Z102.4 25.5,11.06 arc-45 25.6,11.3 arc45 25.75,11.66 U201.PD4
  Top 0.254: Z102.7 Z102.4
MAINBUS_NCS
  Top 0.102: J101.20 arc-16 26.9,3.5 arc-31 26.5,4.95 Z102.9 | Z102.2 26.5,10.21 arc45 26.4,10.45 arc-45 26.25,10.81 U201.PD6
  Top 0.254: Z102.9 Z102.2
MAINBUS_SCK
  Top 0.102: Z102.10 27,7.45 arc34 J101.19 | Z102.1 27,10.3 arc45 26.75,10.9 arc-45 26.5,11.5 26.5,13.76 arc-45 26.6,14 arc45 26.75,14.36 U201.PD7
  Top 0.254: Z102.10 Z102.1
MOTOR_A  (via drill 0.2)  (6 unrouted)
  Top 0.24: U302.6 v15,15.25
  Top 0.254: v8,25.85 8,27.44 T401.P10
  Route15 0.254: v15,15.25 15,20.65 arc45 14.26,22.44 11.64,25.06 arc45 9.73,25.85 v8,25.85
  Bottom 0.203: 7,26.5 D402.P2
  Bottom 0.254: R410.1 7,26.5
  pour Bottom (no thermals): 6.8,26.35 6.8,26.82 arc-90 6.9,26.93 7.1,26.93 arc-90 7.2,26.82 7.2,26.35 arc90 7.5,26.05 8,26.05 arc-90 8.2,25.85 arc-90 8,25.65 7.5,25.65 arc-90
  pour Top (no thermals): 7.8,26.1 8.4,26.1 arc90 8.6,26.3 8.6,29.2 arc-90 8.85,29.45 arc90 9.3,29.9 9.3,31.5 arc-90 9.5,31.7 arc90 9.8,32 9.8,33.5 arc90 9.3,34 8.25,34 arc-90 7.35,34.9 7.35,35.3 arc90 6.1,36.55 arc90 4.8,35.25 4.8,31.95 arc90 5.25,31.5 5.3,31.5 arc-90 5.7,31.1 5.7,30.15 arc90 6.3,29.55 7.15,29.55 arc-90 7.55,29.15 7.55,26.35 arc90
MOTOR_B  (via drill 0.2)  (6 unrouted)
  Top 0.24: U302.11 v17.75,12.5
  Top 0.254: v16.9,24.85 16.9,26.46 T402.P10
  Route15 0.254: v17.75,12.5 17.75,13.14 arc45 17.6,13.5 arc-45 17,14.95 17,24.61 arc45 v16.9,24.85
  Bottom 0.203: 17.5,25 D404.P2
  Bottom 0.254: R412.1 17.5,25
  pour Top (no thermals): 16.65,25.1 17.25,25.1 arc90 17.45,25.3 17.45,28.1 arc-90 17.95,28.6 18.7,28.6 arc90 19.3,29.2 19.3,30.75 arc-90 19.5,30.95 arc90 19.85,31.3 19.85,33.15 arc90 19,34 18.4,34 arc-90 17.5,34.9 17.5,35.3 arc90 16.25,36.55 16,36.55 arc90 14.95,35.5 14.95,31.5 arc90 15.5,30.95 15.65,30.95 arc-90 15.95,30.65 15.95,30.5 arc-44 15.85,30.25 arc44 15.75,30 15.75,29.07 arc44 15.85,28.82 arc-44 16.4,27.45 16.4,25.35 arc90
  pour Bottom (no thermals): 17.05,25.2 17.82,25.2 arc-90 17.93,25.1 17.93,24.9 arc-90 17.82,24.8 17.15,24.8 arc90 17.1,24.75 arc-90 17,24.65 16.9,24.65 arc-90 16.7,24.85 arc-90
MOTOR_C  (via drill 0.2)  (6 unrouted)
  Top 0.24: U302.14 v19.25,13
  Top 0.254: T403.P10 v28.05,28.15
  Route15 0.25: v28.05,28.15 arc-45 27.59,27.04 25.35,24.8 arc-45 24.63,24.5 23.7,24.5
  Route15 0.254: v19.25,13 v19.26,13.01 arc45 20,14.8 20,18.76 arc-45 20.1,19 arc45 20.25,19.36 20.25,20.65 arc-45 20.99,22.44 22.59,24.04 arc-45 23.7,24.5
  Bottom 0.203: D406.P2 27.5,28
  Bottom 0.254: 27.5,28 R418.1
  pour Bottom (no thermals): 27.07,27.9 27.07,28.1 arc-90 27.18,28.2 27.8,28.2 arc90 27.85,28.25 arc-90 27.95,28.35 28.05,28.35 arc-90 28.25,28.15 arc-90 27.9,27.8 27.18,27.8 arc-90
  pour Top (no thermals): 28.6,25.35 arc-90 28.35,25.1 27.75,25.1 arc-90 27.55,25.3 27.55,28.25 arc90 27.3,28.5 26.35,28.5 arc-90 25.7,29.15 25.7,30.75 arc90 25.5,30.95 arc-90 25.1,31.35 25.1,35.5 arc-90 26.15,36.55 26.5,36.55 arc-90 27.65,35.4 27.65,34.95 arc90 28.65,33.95 29.05,33.95 arc-90 30,33 30,31.4 arc-90 29.55,30.95 arc90 29.3,30.7 29.3,28.9 arc-90 28.9,28.5 arc90 28.6,28.2
N$1  (1 unrouted)
  pour Top (no thermals): 6.15,14 6.15,13.65 arc-90 6.1,13.6 4.05,13.6 arc-90 3.9,13.75 3.9,14.75 arc-90 4,14.85 4.15,14.85 arc-90 4.25,14.75 4.25,14.15 arc90 4.35,14.05 6.1,14.05 arc-90
N$2  (2 unrouted)
  pour Top (no thermals): 15.25,9.1 15.25,8.8 arc90 15.45,8.6 16.2,8.6 arc90 16.4,8.8 16.4,9.15 arc53 16.15,9.65 arc-53 15.9,10.15 15.9,11.2 arc90 15.7,11.4 12.25,11.4 arc90 12.05,11.2 12.05,10.8 arc90 12.25,10.6 12.75,10.6 arc-90 13.15,10.2 13.15,9.95 arc90 13.35,9.75 14.6,9.75 arc-90
N$3  (1 unrouted)
  pour Top (no thermals): 6.15,13 6.15,13.35 arc90 6.1,13.4 4.05,13.4 arc90 3.9,13.25 3.9,12.25 arc90 4,12.15 4.15,12.15 arc90 4.25,12.25 4.25,12.85 arc-90 4.35,12.95 6.1,12.95 arc90
N$5
  pour Top (no thermals): 12.65,29 12.65,27.85 arc90 12.8,27.7 13.2,27.7 arc90 13.35,27.85 13.35,28.45 arc-90 13.85,28.95 14.95,28.95 arc90 15.25,29.25 15.25,29.75 arc90 14.95,30.05 13.7,30.05 arc90
N$7  (via drill 0.2)  (2 unrouted)
  Bottom 0.203: D402.P1 7,27.5
  Bottom 0.254: 7,27.5 R410.2 R403.1
  other vias: 5.85,28.95
  pour Top (no thermals): 6.1,28.25 5.6,28.25 arc-90 5.5,28.35 5.5,29 arc-90 5.75,29.25 5.95,29.25 arc-90 6.2,29 6.2,28.35 arc-90
  pour Bottom (no thermals): 6.9,27.07 7.1,27.07 arc90 7.2,27.18 7.2,27.8 arc90 5.85,29.15 arc90 5.65,28.95 arc90 5.85,28.75 arc-90 6.8,27.8 6.8,27.18 arc90
N$8
  pour Top (no thermals): 9.75,30.75 9.75,30.25 arc90 10.05,29.95 10.45,29.95 arc-90 10.6,29.8 10.6,28.9 arc90 10.75,28.75 11.25,28.75 arc90 11.4,28.9 11.4,30.75 arc90 11.1,31.05 10.05,31.05 arc90
N$9
  pour Top (no thermals): 4.05,30.75 4.05,28.95 arc90 4.25,28.75 4.75,28.75 arc90 4.85,28.85 4.85,29.85 arc-90 4.95,29.95 arc90 5.25,30.25 5.25,30.75 arc90 4.95,31.05 4.35,31.05 arc90
N$10  (via drill 0.2)
  Top 0.25: D201.1 15.62,38.55
  Top 0.254: 15.62,38.55 15.5,38.55 arc-90 v14.5,39.55
  Bottom 0.254: R203.1 v14.5,39.55
N$11
  pour Top (no thermals): 29.75,29.7 29.75,29.75 arc-90 30.05,30.05 30.65,30.05 arc-90 30.95,29.75 30.95,27.9 arc-90 30.8,27.75 30.3,27.75 arc-90 30.15,27.9 30.15,28.85 arc90 30.05,28.95 arc-90 29.75,29.25
N$12  (via drill 0.2)  (2 unrouted)
  Bottom 0.203: D401.P1 9,27.5
  Bottom 0.254: R409.2 9,27.5 R407.1
  other vias: 9.15,28.95
  pour Top (no thermals): 9.4,28.25 8.9,28.25 arc-90 8.8,28.35 8.8,29 arc-90 9.05,29.25 9.25,29.25 arc-90 9.5,29 9.5,28.35 arc-90
  pour Bottom (no thermals): 8.9,27.07 9.1,27.07 arc90 9.2,27.18 9.2,28.7 arc-90 9.25,28.75 arc90 9.35,28.85 9.35,28.95 arc90 9.15,29.15 arc90 8.8,28.8 8.8,27.18 arc90
N$13
  pour Top (no thermals): 19.75,29.75 19.75,29.25 arc90 20.05,28.95 arc-90 20.15,28.85 20.15,27.85 arc90 20.25,27.75 20.85,27.75 arc90 20.95,27.85 20.95,29.75 arc90 20.65,30.05 20.05,30.05 arc90
N$14  (via drill 0.2)  (2 unrouted)
  Bottom 0.203: 26.5,28 D406.P1
  Bottom 0.254: 26.5,28 R418.2 26.5,29.65 arc90 26.15,30 R414.1
  other vias: 25.85,28
  pour Top (no thermals): 26.1,27.25 25.6,27.25 arc-90 25.5,27.35 25.5,28 arc-90 25.75,28.25 25.95,28.25 arc-90 26.2,28 26.2,27.35 arc-90
  pour Bottom (no thermals): 25.85,28.2 26.82,28.2 arc-90 26.93,28.1 26.93,27.9 arc-90 26.82,27.8 25.85,27.8 arc-90 25.65,28 arc-90
N$15  (via drill 0.2)  (2 unrouted)
  Bottom 0.203: D405.P1 29,27
  Bottom 0.254: 29,27 R417.2 R416.1
  other vias: 29.15,28
  pour Top (no thermals): 29.4,27.25 28.9,27.25 arc-90 28.8,27.35 28.8,28 arc-90 29.05,28.25 29.25,28.25 arc-90 29.5,28 29.5,27.35 arc-90
  pour Bottom (no thermals): 28.9,26.57 arc-90 28.8,26.68 28.8,27.85 arc-90 29.15,28.2 arc-90 29.35,28 29.35,27.9 arc-90 29.25,27.8 arc90 29.2,27.75 29.2,26.68 arc-90 29.1,26.57
N$16
  pour Top (no thermals): 24.05,29.75 24.05,27.9 arc90 24.2,27.75 24.7,27.75 arc90 24.85,27.9 24.85,28.85 arc-90 24.95,28.95 arc90 25.25,29.25 25.25,29.75 arc90 24.95,30.05 24.35,30.05 arc90
N$17  (via drill 0.2)  (2 unrouted)
  Bottom 0.203: D404.P1 18.5,25
  Bottom 0.254: 18.5,25 R412.2 19,26 arc90 19.5,26.5 arc90 19,27 R404.1
  other vias: 19.15,25
  pour Top (no thermals): 18.9,25.75 19.4,25.75 arc-90 19.5,25.65 19.5,25 arc-90 19.25,24.75 19.05,24.75 arc-90 18.8,25 18.8,25.65 arc-90
  pour Bottom (no thermals): 18.07,24.9 18.07,25.1 arc-90 18.18,25.2 19.15,25.2 arc-90 19.35,25 arc-90 19.15,24.8 18.18,24.8 arc-90
N$18  (via drill 0.2)  (2 unrouted)
  Bottom 0.203: D403.P1 15.5,25
  Bottom 0.254: R408.1 15.9,27 arc-90 16.5,26.4 16.5,26 | v15.85,25 16.3,25 arc90 16.5,25.2 16.5,26 | R411.2 16.5,26
  pour Top (no thermals): 15.6,25.75 16.1,25.75 arc-90 16.2,25.65 16.2,25 arc-90 15.95,24.75 15.75,24.75 arc-90 15.5,25 15.5,25.65 arc-90
  pour Bottom (no thermals): 15.07,24.9 15.07,25.1 arc-90 15.18,25.2 15.85,25.2 arc-90 16.05,25 arc-90 15.85,24.8 15.18,24.8 arc-90
N$21  (via drill 0.2)
  Top 0.25: D201.2 16.2,39.45
  Top 0.254: 16.2,39.45 16.12,39.45 arc-45 15.15,39.85 arc45 14.18,40.25 v13.4,40.25
  Bottom 0.254: v13.4,40.25 12.8,40.25 arc90 12.5,39.95 R204.1
N$23  (via drill 0.2)
  Top 0.25: D201.3 18.8,39.45
  Top 0.254: 18.8,39.45 20.38,39.45 arc45 v20.5,39.5
  Bottom 0.254: R205.1 v20.5,39.5
NRST
  Top 0.102: U201.NRST 28.4,18.1 arc46 28.65,18 29.6,18 arc35 30.55,18.3 arc20 30.95,18.7 arc38 31.05,19.05 U101.4
NRST_  (via drill 0.2)
  Top 0.25: U101.1 33.55,22.3 arc-90 34.3,21.55 34.3,5.22
  Top 0.254: U101.1 U101.2 v32,21.5 | 34.3,5.22 arc-31 33.75,3.2 arc-37 31.9,1.6 arc-26 30.7,1.4 25.2,1.4 arc-54 J101.16
  Route2 0.254: J101.16 23.57,1.74 arc45 25.36,1 31,1 arc90 34.45,4.45 34.45,20.5 arc90 33.45,21.5 v32,21.5
  Bottom 0.254: v32,21.5 R102.2
OSC_IN
  Top 0.28: U201.PF0 29.3,17.25 arc-14 29.7,17.2 arc15 30.55,17.1 Y201.P3
PGND  (via drill 0.2)  (52 unrouted)
  Top 0.24: C306.2 17.25,20.98 arc45 17.2,21.1 arc45 16.96,21.2 | U302.30 17.75,17 v17.5,17 | U302.8 16.75,14.25 | 16.75,14.25 U302.9 | 16.75,14.25 v17.5,15 | U302.33 20.25,14.25 U302.16
  Top 0.254: C304.2 14,20.75 arc-90 14.45,21.2 16.96,21.2
  Bottom 0.203: D401.P2 9,26.5 | D405.P2 29,26
  Bottom 0.254: 9,26.5 R409.1 | 29,26 R417.1 | R411.1 14.15,26 arc90 14,25.85 v14,25
  other vias: 19.5,17 18.5,17 17.5,16 18.5,16 19.5,16 19.5,15 18.5,15 30.5,26.5 29.5,24.5 30,25 30.5,25.5 31,26 30,26 12,21 9,23 18.5,16.5 18.5,17.5 18.5,15.5 18.5,14.5 17.5,14.5 17.5,15.5 17.5,16.5 17.5,17.5 19.5,17.5 19.5,16.5 19.5,15.5 19.5,14.5 8,23
  pour Top (no thermals): 16.2,27.55 arc90 16.05,27.7 15.3,27.7 arc90 15.15,27.55 15.15,27.5 arc-90 15,27.35 12.65,27.35 arc-90 12.5,27.5 12.5,28.1 arc90 12.3,28.3 10.8,28.3 arc90 10.65,28.15 arc-90 10.55,28.05 8.9,28.05 arc90 8.8,27.95 8.8,25.4 arc-90 8.45,25.05 8.05,25.05 arc90 7.8,24.8 7.8,23.37 arc-41 7.45,22.34 6.02,20.91 arc55 5.35,19 arc86 6.41,18.15 12.6,18.15 arc90 12.9,18.45 arc-90 13.25,18.8 14.25,18.8 arc90 14.5,19.05 14.5,22.5 arc-90 14.9,22.9 15.95,22.9 arc90 16.2,23.15 16.2,23.95 arc90 15.75,24.4 arc-90 15.35,24.8 15.35,25.75 arc-90 15.55,25.95 16.05,25.95 arc90 16.2,26.1
  pour Top (no thermals): 16.3,14.45 15.8,14.45 arc90 15.7,14.35 15.7,13.3 arc90 15.8,13.2 16.85,13.2 arc90 16.95,13.3 16.95,13.8 arc-90 17.35,14.2 19.65,14.2 arc-90 20.05,13.8 20.05,13.3 arc90 20.15,13.2 20.35,13.2 arc90 20.45,13.3 20.45,17.6 arc90 20.25,17.8 18.05,17.8 arc-90 17.95,17.9 17.95,18.7 arc90 17.85,18.8 17.65,18.8 arc90 17.55,18.7 17.55,17.9 arc-90 17.45,17.8 16.85,17.8 arc90 16.7,17.65 16.7,14.85 arc-90
  pour Top (no thermals): 28.8,24.55 28.8,26.95 arc-90 28.95,27.1 29.9,27.1 arc90 30,27.2 arc-90 30.1,27.3 31.3,27.3 arc-90 31.5,27.1 31.5,25.25 arc-90 29.15,22.9 28.1,22.9 arc-90 27.8,23.2 27.8,24 arc-90 28.15,24.35 28.6,24.35 arc90
  pour Bottom (no thermals): 8.9,26.93 9.1,26.93 arc-90 9.2,26.82 9.2,23 arc-90 9,22.8 arc-90 8.8,23 8.8,26.82 arc-90
  pour Bottom (no thermals): 28.8,25.85 28.8,26.32 arc-90 28.9,26.43 29.1,26.43 arc-90 29.2,26.32 29.2,25.85 arc90 29.35,25.7 30.5,25.7 arc-90 30.7,25.5 arc-90 30.5,25.3 29.35,25.3 arc-90
  pour Bottom (no thermals): 14,25.2 14.82,25.2 arc-90 14.93,25.1 14.93,24.9 arc-90 14.82,24.8 14,24.8 arc-90 13.8,25 arc-90
  pour Bottom: 16,18.5 19,18.5 arc-90 20.5,17 20.5,12 arc-90 19.5,11 18,11 arc90 14,7 arc90 14.5,6.5 14.5,1 9,1 9,6.5 arc-58 11.5,11 arc58 14,15.5 14,16.5 arc-90
  pour Route2 (no thermals): 16.5,0 16.5,6.5 arc-23 13.5,7 arc-36 11,9 arc-33 9.5,14 9.5,17 arc-90 10.5,18 arc-90 13.5,15 13.5,14 arc90 13.95,13.55 20.04,13.55 arc90 20.45,13.96 20.45,19 arc-90 23.95,22.5 30.5,22.5 arc90 32,24 32,26.4 arc90 31.4,27 27.2,27 arc44 24.7,26 24.25,25.55 arc-44 22.87,25 21.05,25 arc40 19.9,24.65 arc-37 19.15,24.4 14.11,24.4 arc-40 13.36,24.65 arc39 12.79,24.85 0,24.85 0,12.5 arc90 0.5,12 2,12 arc-90 2.5,11.5 arc-90 2,11 0.5,11 arc90 0,10.5 0,0
UART_RX  (via drill 0.2)
  Top 0.102: U201.PA3 27.9,19.9 arc46 28,20.15 v28,22
  Bottom 0.203: 14.8,32.09 14.8,35.6
  Bottom 0.25: v28,22 28.32,21.68 arc45 28.75,21.5 29.14,21.5 arc45 29.44,21.62 arc45 29.55,21.89 29.55,22.22 arc45 29.39,22.61 arc45 28.57,22.95 26.27,22.95 arc-45 24.87,23.53 24.47,23.93 arc45 23.1,24.5 22.14,24.5 arc-90 20.35,26.29 20.35,26.3 arc90 18.9,27.75 16.8,27.75 arc-90 16,28.55 Z104.2 Z104.9 16,30.4 arc45 15.75,31 14.9,31.85 arc-45 14.8,32.09 | 14.8,35.6 arc45 14.55,36.2 arc45 14.07,36.4 10.79,36.4 arc45 9,35.66 J102.3
UART_TX  (via drill 0.2)
  Top 0.102: U201.PA2 27.9,19.1 arc46 28.15,19 v30,19
  Bottom 0.203: 15.15,32.41 15.15,35.48
  Bottom 0.25: v30,19 30,22.4 arc45 29.82,22.83 arc45 28.44,23.4 26.55,23.4 arc-45 24.93,24.07 24.79,24.21 arc45 23,24.95 22.15,24.95 arc-90 20.8,26.3 arc90 18.95,28.15 16.95,28.15 arc-90 16.5,28.6 Z104.1 Z104.10 16.5,30.21 arc45 16.05,31.3 15.3,32.05 arc-45 15.15,32.41 | 15.15,35.48 arc-45 15.45,36.2 arc-45 16.05,36.45 16.54,36.45 arc-45 18.33,35.71 J102.11
VCC  (via drill 0.2)  (11 unrouted)
  other vias: 10,16 10,16.5 10,17 1,11.5 1.5,11.5 2,11.5
  pour Top (no thermals): 0,7 3,7 arc90 3.35,7.35 3.35,10.68 arc-33 3.55,11.35 arc33 3.65,11.68 3.65,13.05 arc90 3.35,13.35 0,13.35
  pour Top (no thermals): 13.05,17.6 10.1,17.6 arc90 9.7,17.2 9.7,15.8 arc90 10,15.5 13.7,15.5 arc90 13.9,15.7 13.9,16.3 arc-90 14.15,16.55 16.4,16.55 arc90 16.5,16.65 16.5,17.3 arc90 16.4,17.4 14.7,17.4 arc-90 14.55,17.55 14.55,17.95 arc90 14.25,18.25 13.7,18.25 arc90 13.45,18 arc-90
  pour Bottom: 1,11 arc-90 0.5,11.5 arc-90 6.5,17.5 10,17.5 arc-90 10.5,17 10.5,16 arc-90 10,15.5 6.5,15.5 arc90 2.5,11.5 arc-90 2,11
VCC_UNFUSED  (4 unrouted)
  pour Top (no thermals): 4.35,1.5 8,1.5 arc90 8.5,2 8.5,10.5 arc90 8,11 4.35,11 arc90 3.85,10.5 3.85,2 arc90
VCP  (1 unrouted)
  pour Top (no thermals): 16.5,16.2 16.5,16.3 arc90 16.4,16.4 14.35,16.4 arc90 14.2,16.25 14.2,15.8 arc90 14.35,15.65 14.65,15.65 arc90 14.8,15.8 14.8,15.95 arc-90 14.95,16.1 16.4,16.1 arc90
VDDSD  (via drill 0.2)  (7 unrouted)
  Top 0.28: v23.25,20.6 U201.VDDSD3 arc90 22.7,19.2 22.7,19.08 arc45 U201.VDDSD12
  Bottom 0.254: v23.25,20.6 arc45 22.16,21.05 18.62,21.05 arc45 16.11,20.01 14.14,18.04 arc45 13.45,16.37 13.45,14.48 arc-45 v12.95,13.25
  pour Top (no thermals): 15.05,9.1 15.05,8.2 arc-90 14.85,8 arc-90 14.65,8.2 arc90 14.25,8.6 11,8.6 arc-90 10.8,8.8 10.8,13.35 arc-90 10.9,13.45 12.95,13.45 arc-90 13.15,13.25 arc-90 12.95,13.05 12.5,13.05 arc90 12.25,12.8 12.25,12 arc-53 12.05,11.6 arc53 11.85,11.2 11.85,10.8 arc90 12.25,10.4 12.75,10.4 arc-90 12.95,10.2 12.95,9.95 arc90 13.35,9.55 14.6,9.55 arc-90
VDRAIN  (2 unrouted)
  pour Top (no thermals): 13.05,17.6 10.1,17.6 arc90 9.7,17.2 9.7,15.8 arc90 10,15.5 13.7,15.5 arc90 13.9,15.7 13.9,16.3 arc-90 14.15,16.55 16.4,16.55 arc90 16.5,16.65 16.5,17.3 arc90 16.4,17.4 14.7,17.4 arc-90 14.55,17.55 14.55,17.95 arc90 14.25,18.25 13.7,18.25 arc90 13.45,18 arc-90
VGLS
  Top 0.24: U302.31 C306.1
VMOTOR  (via drill 0.2)  (35 unrouted)
  other vias: 22.5,26 2,26 3,26 2,27 3,27 2.5,26.5 23,26.5 23.5,26 23.5,27 22.5,27 3.5,26.5 4,26 4,27 22,26.5 21.5,26 21.5,27
  pour Top (no thermals): 17.65,24.8 17.65,27.7 arc-90 17.9,27.95 19.55,27.95 arc-90 19.75,27.75 19.75,27.7 arc90 20.2,27.25 25.05,27.25 arc-90 25.2,27.1 arc90 25.25,27.05 26.15,27.05 arc90 26.35,27.25 26.35,27.7 arc-90 26.6,27.95 27.1,27.95 arc-90 27.35,27.7 27.35,25.3 arc-30 27.25,25.05 arc37 27.2,24.9 27.2,23.2 arc-90 26.9,22.9 25.5,22.9 arc-55 23.5,23.95 arc53 22.5,24.5 20.3,24.5 arc-90 19.65,25.15 19.65,25.7 arc90 19.4,25.95 18.9,25.95 arc90 18.65,25.7 18.65,23.5 arc-90 18.05,22.9 17.05,22.9 arc-90 16.8,23.15 16.8,24 arc-90 17.2,24.4 17.25,24.4 arc90
  pour Route2: 1.25,26.75 arc90 2.5,25.5 6.5,25.5 arc53 7.5,26 arc-53 8,26.25 arc-53 8.5,26 arc53 9.5,25.5 23,25.5 arc90 24.25,26.75 arc90 23,28 22,28 arc-28 21,28.25 arc28 20,28.5 17.5,28.5 arc44 16.5,28.1 arc-44 15.5,27.7 15,27.7 arc-44 14,28.1 arc44 13,28.5 2.5,28.5 arc90 1.25,27.25
  pour Top (no thermals): 3.4,13.65 arc90 3.7,13.95 3.7,15 arc-30 4.1,16.5 arc30 4.5,18 4.5,19.3 arc-51 5.63,21.61 arc8 6.75,22.65 arc44 7.2,23.8 7.2,25.4 arc-28 7.3,25.8 arc28 7.35,26 7.35,28.65 arc90 7.05,28.95 6.6,28.95 arc90 6.35,28.7 6.35,28.15 arc-90 6.25,28.05 5.4,28.05 arc-53 5.2,28.15 arc53 5,28.25 0,28.25 0,13.65
VREFSD+  (via drill 0.2)  (2 unrouted)
  Top 0.28: U201.VREFSD+ v23.25,18.75
  Bottom 0.254: v23.25,18.75 22.72,18.22 arc-45 21.35,17.65 21.12,17.65 arc-45 20.4,17.95 arc45 19.31,18.4 15.79,18.4 arc45 14.7,17.95 14.69,17.94 arc45 13.95,16.15 13.95,14.8 arc-45 13.07,12.66 v12.95,12.55
  pour Top (no thermals): 16.8,8.6 17.3,8.6 arc90 17.5,8.8 17.5,11.5 arc90 16.95,12.05 13.65,12.05 arc-90 13.15,12.55 arc90 12.95,12.75 arc90 12.75,12.55 arc90 13.65,11.65 15.65,11.65 arc-90 16.1,11.2 16.1,10.25 arc53 16.35,9.75 arc-53 16.6,9.25 16.6,8.8 arc90
VSSSD  (via drill 0.2)  (9 unrouted)
  Top 0.152: U201.VSSSD arc-45 22.91,17.39 22.64,17.66 arc-45 22.3,18.48 22.3,19.78 arc-45 22.7,20.75 arc-45 23.3,21 v23.75,21
  Top 0.28: U201.VREFSD- U201.PE14 v23.75,21
  Bottom 0.254: v10.3,13.85 12.06,13.85 arc45 12.81,14.16 arc45 12.95,14.5 12.95,16.45 arc-45 13.69,18.24 15.91,20.46 arc-45 18.43,21.5 22.93,21.5 arc-45 23.48,21.27 v23.75,21
  pour Top (no thermals): 6.4,14.25 4.9,14.25 arc-90 4.85,14.3 4.85,14.65 arc-90 4.9,14.7 10.4,14.7 arc-90 10.6,14.5 10.6,14.15 arc90 10.7,14.05 12.05,14.05 arc-90 12.15,13.95 12.15,13.7 arc-90 12.05,13.6 10.7,13.6 arc90 10.6,13.5 10.6,8.8 arc90 11,8.4 14.25,8.4 arc-90 14.45,8.2 arc90 14.85,7.8 arc90 15.25,8.2 arc-90 15.45,8.4 17.3,8.4 arc-90 17.5,8.2 17.5,6.65 arc-90 17.35,6.5 13.8,6.5 arc90 13.5,6.2 13.5,2 arc-90 13,1.5 9.35,1.5 arc-90 8.85,2 8.85,11.95 arc90 8.5,12.3 4.9,12.3 arc-90 4.85,12.35 4.85,12.7 arc-90 4.9,12.75 6.4,12.75 arc90 6.5,12.85 6.5,14.15 arc90

## Text on the board
tPlace: ENC | HALL | NCS | SCK | A | B | A | RX | MISO | MOSI | B | TX | C | 5V | C | GND | Motor Controller | Pasta 05 | 15V | 3V3 | JDO | JCK | DO | SCK | GND | VCC | GND | 5V | JMS | JDI | RST | DI | NCS | GND
bPlace: STM | +3V3 Filtering